# Altium schematic sheet 电源部分.SchDoc
size A4
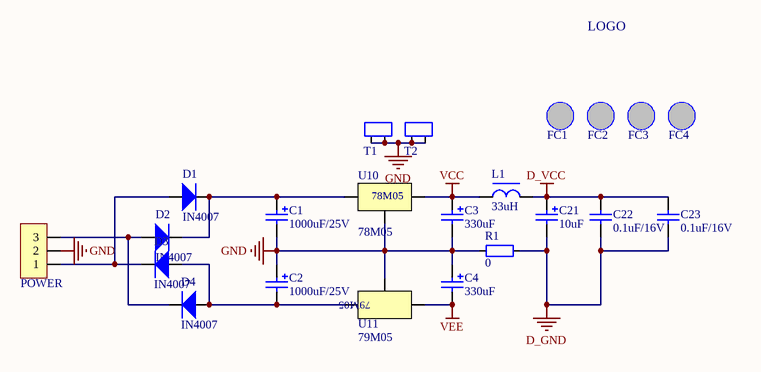
[diagram p0: 电源部分.SchDoc]

## Parts
?  LOGO  [LOGO_1]  (value not drawn)
C1  value 1000uF/25V  [CR5]  (hidden comment: CAP POL)
C2  value 1000uF/25V  [CR5]  (hidden comment: CAP POL)
C3  value 330uF  [CR3]  (hidden comment: CAP POL)
C4  value 330uF  [CR3]  (hidden comment: CAP POL)
C21  value 10uF  [CR2]  (hidden comment: CAP POL)
C22  value 0.1uF/16V  [C0603]  (hidden comment: CAP_SMD)
C23  value 0.1uF/16V  [C0603]  (hidden comment: CAP_SMD)
D1  IN4007  [DO-214]
D2  IN4007  [DO-214]
D3  IN4007  [DO-214]
D4  IN4007  [DO-214]
FC1  Fixed Column  [M3*5]  (value not drawn)
FC2  Fixed Column  [M3*5]  (value not drawn)
FC3  Fixed Column  [M3*5]  (value not drawn)
FC4  Fixed Column  [M3*5]  (value not drawn)
L1  value 33uH  [R1206]  (hidden comment: Lnductor)
POWER  Socket P3  [XH254-3]  (value not drawn)
R1  value 0  [R1206]  (hidden comment: RES_SMD)
T1  Thermal  [Thermal_4]  (value not drawn)
T2  Thermal  [Thermal_4]  (value not drawn)
U10  78M05  [TO-220]
U11  79M05  [TO-220]

## Nets
D_GND: C21.2 C22.1 C23.1 R1.2
D_VCC: C21.1 C22.2 C23.2 L1.2
GND: C1.2 C2.1 C3.2 C4.1 POWER.2 R1.1 T1.1 T1.2 T2.1 T2.2 U10.2(GND) U11.1(GND)
VCC: C3.1 L1.1 U10.3(OUT)
VEE: C4.2 U11.3(OUT)
NetC1_1: C1.1 D1.2 D2.2 U10.1(IN)
NetC2_2: C2.2 D3.1 D4.1 U11.2(IN)
NetD1_1: D1.1 D3.2 POWER.1
NetD2_1: D2.1 D4.2 POWER.3

## Library data of the parts
C1-C4 C21 = CAP POL: 插脚有极电容
C22 C23 = CAP_SMD: 贴片无极电容
FC1-FC4 = Fixed Column: 直径M3的PCB固定孔
R1 = RES_SMD: 贴片电阻
T1 T2 = Thermal: PCB安装式TO220散热器
U10 = 78M05_T
U11 = 79M05_T